# Altium schematic sheet Sheet1.SchDoc
size A3; SheetNumber: 1; SheetTotal: 1
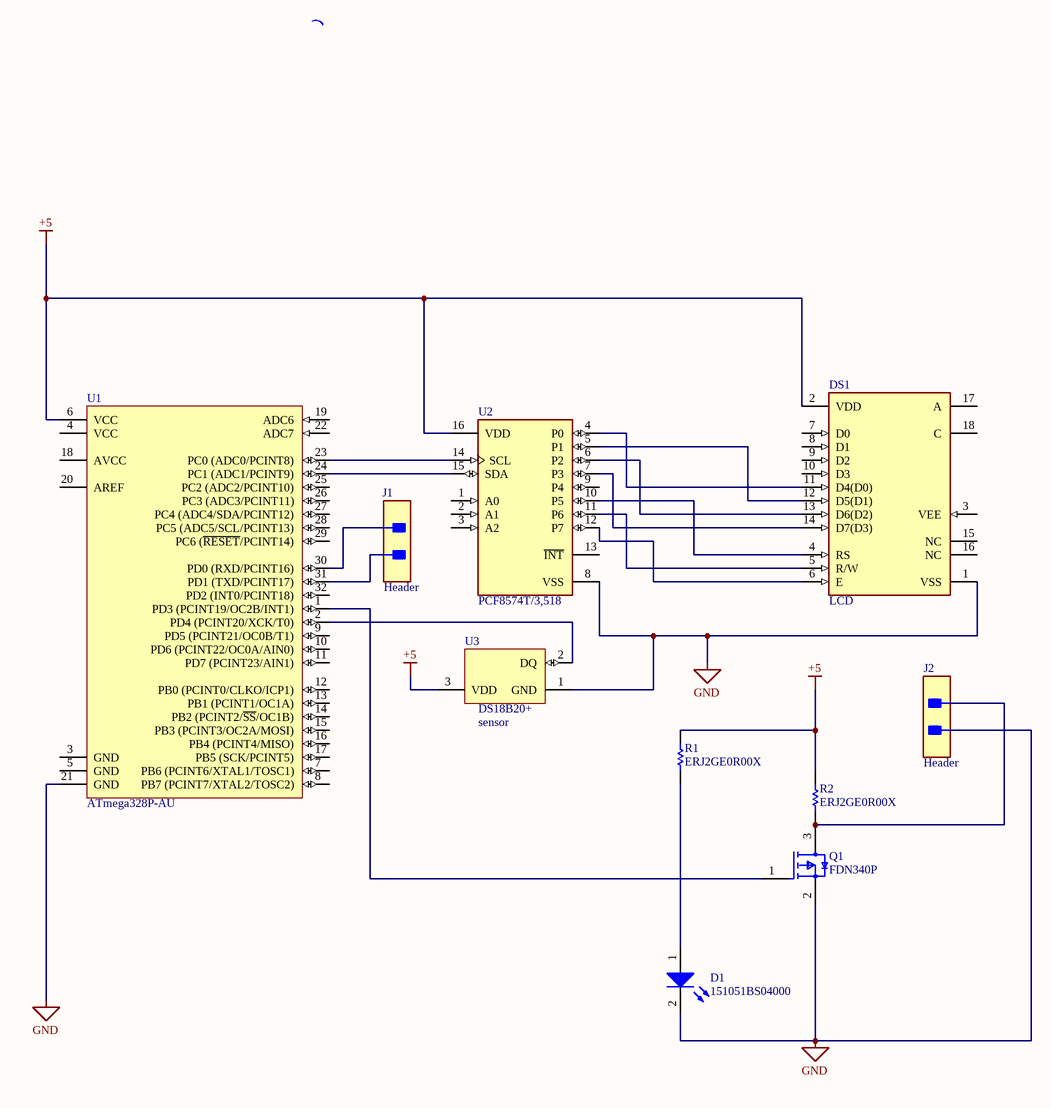
[diagram p0: Sheet1.SchDoc]

## Parts
D1  151051BS04000  [WL-TMRC_D5.9H8.7]
DS1  LCD  [FP-EA_DIP162-DHNLED-MFG]
J1  Header  [FP-SYP-02T-1-MFG]
J2  Header  [FP-SYP-02T-1-MFG]
Q1  FDN340P  [FP-527AG-MFG]
R1  ERJ2GE0R00X  [RESC1005X40X25LL05T05]
R2  ERJ2GE0R00X  [RESC1005X40X25LL05T05]
U1  ATmega328P-AU  [32A_M]
U2  PCF8574T/3,518  [FP-SOT162-1-MFG]
U3  DS18B20+  [Q3+1]

## Nets
+5: DS1.2(VDD) R1.2 R2.2 U1.6(VCC) U2.16(VDD) U3.3(VDD)
GND: D1.2(K) DS1.1(VSS) Q1.2(S) U1.21(GND) U2.8(VSS) U3.1(GND)
NetD1_1: D1.1(A) R1.1
NetDS1_4: DS1.4(RS) U2.10(P5)
NetDS1_5: DS1.5(R/W) U2.11(P6)
NetDS1_6: DS1.6(E) U2.12(P7)
NetDS1_11: DS1.11(D4(D0)) U2.4(P0)
NetDS1_12: DS1.12(D5(D1)) U2.5(P1)
NetDS1_13: DS1.13(D6(D2)) U2.6(P2)
NetDS1_14: DS1.14(D7(D3)) U2.7(P3)
NetQ1_1: Q1.1(G) U1.1(PD3_(PCINT19/OC2B/INT1))
NetQ1_3: Q1.3(D) R2.1
NetU1_2: U1.2(PD4_(PCINT20/XCK/T0)) U3.2(DQ)
NetU1_23: U1.23(PC0_(ADC0/PCINT8)) U2.14(SCL)
NetU1_24: U1.24(PC1_(ADC1/PCINT9)) U2.15(SDA)

Not connected (* = marked no-connect by the designer): DS1 3(VEE) 7(D0) 8(D1) 9(D2) 10(D3) 15(NC) 16(NC) 17(A) 18(C); U1 3(GND) 4(VCC) 5(GND) 7(PB6_(PCINT6/XTAL1/TOSC1)) 8(PB7_(PCINT7/XTAL2/TOSC2)) 9(PD5_(PCINT21/OC0B/T1)) 10(PD6_(PCINT22/OC0A/AIN0)) 11(PD7_(PCINT23/AIN1)) 12(PB0_(PCINT0/CLKO/ICP1)) 13(PB1_(PCINT1/OC1A)) 14(PB2_(PCINT2/~{SS}/OC1B)) 15(PB3_(PCINT3/OC2A/MOSI)) 16(PB4_(PCINT4/MISO)) 17(PB5_(SCK/PCINT5)) 18(AVCC) 19(ADC6) 20(AREF) 22(ADC7) 25(PC2_(ADC2/PCINT10)) 26(PC3_(ADC3/PCINT11)) 27(PC4_(ADC4/SDA/PCINT12)) 28(PC5_(ADC5/SCL/PCINT13)) 29(PC6_(~{RESET}/PCINT14)) 30(PD0_(RXD/PCINT16)) 31(PD1_(TXD/PCINT17)) 32(PD2_(INT0/PCINT18)); U2 1(A0) 2(A1) 3(A2) 9(P4) 13(~{INT})

## Notes on the sheet
- (near U3) sensor

## Library data of the parts
D1 = CMP-1488-00009-2: NexarPartId: 29717812; Test Current: 20mA; Forward Voltage: 3.2V; Wavelength: 470nm; Lens Size: 5mm; Lens Style: Circular, Diffused, Round; Forward Current: 100mA; Peak Wavelength: 465nm; Viewing Angle: 40°; Luminous Intensity: 500mcd; Max Reverse Voltage (DC): 5V; Color: Blue; Case/Package: Radial; Width: 5mm; Mount: Through Hole; Min Operating Temperature: -40°C; Length: 5mm; Height: 8.6mm; Max Operating Temperature: 85°C; Packaging: Bulk; RoHS: Compliant; REACH SVHC: Unknown; Dominant Wavelength: 470nm
DS1 = CMP-140401-000001-1: LCD MOD CHAR 2X16 Y/G BACKLIT; Manufacturer Part Number: EA DIP162-DHNLED; Manufacturer: Display Visions; Number Of Characters: 32; Min Supply Voltage: 2.7V; Max Supply Voltage: 5V; Interface: Parallel; Colour: Yellow/Green; Temperature Range High: +70°C; Device Class L2: Displays; Height: 11mm; Device Class L3: LCD; Display Type: LCD; Package: EA DIP162-DHNLED; Lead Free: Yes; Digikey Description: LCD MOD CHAR 2X16 Y/G BACKLIT; RoHS: TRUE; Device Class L1: Optoelectronics; Automotive: No; ComponentLink2Description: Datasheet; Octopart: https://octopart.com/ea+dip162-dhnled-display+visions-99339882; Temperature Range Low: -20°C; Category: Disp; Temperature: -20°C to +70°C; ComponentLink2URL: https://www.lcd-module.de/fileadmin/eng/pdf/doma/dip162-de.pdf
J1 J2 = CMP-17439-000354-1: CONN PLUG HSNG 2POS 2.5MM RED; Number of Contacts: 2; Gender: Male; Pitch: 0.098inch; Height: 3.2mm; Contact Material: Bronze; Packaging: Bulk; Color: Red; Mount: Free Hanging; Contact Type: Female Socket; Contact Plating: Tin; Number of Rows: 1; Number of Positions: 2; REACH SVHC: No SVHC; Fastening Type: Ramp; Termination: Crimp; Connector Type: Plug; Series: RCY; Housing Material: Nylon; Orientation: Straight
Q1 = CMP-2100-03638-2: MOSFET P-CH 20V 2A SSOT3; Fall Time: 11ns; Rise Time: 9ns; Voltage Rating (DC): -20V; Power Dissipation: 500mW; Nominal Vgs: -800mV; Current Rating: -2A; Gate to Source Voltage (Vgs): 8V; Rds On Max: 70mR; Turn-Off Delay Time: 27ns; Element Configuration: Single; Number of Elements: 1; Input Capacitance: 779pF; Drain to Source Resistance: 60mR; Turn-On Delay Time: 10ns; Package Quantity: 1; Mount: Surface Mount; Case/Package: SOT-23; Min Operating Temperature: -55°C; REACH SVHC: No SVHC; Weight: 0.03g; Packaging: Tape and Reel; Threshold Voltage: -800mV; Max Operating Temperature: 150°C; Dual Supply Voltage: -20V; Termination: SMD/SMT; Drain to Source Voltage (Vdss): 20V; Height: 0.94mm; Length: 2.92mm; Contact Plating: Tin; Width: 3.05mm; Drain to Source Breakdown Voltage: -20V; Max Power Dissipation: 500mW; Continuous Drain Current (ID): 2A; Number of Pins: 3; Lead Free: Lead Free; Radiation Hardening: No; On-State Resistance: 70MR
R1 R2 = CMP-2000-07451-1: Chip Resistor, 0 Ohm, 0.1 W, -55 to 155 degC, 0402 (1005 Metric), RoHS, Tape and Reel; Manufacturer: Panasonic; Voltage Rating (DC): 50V; Temperature Coefficient: 600ppm/��C; Max Power Dissipation: 100mW; Resistance: 0mOhm; Tolerance: 5%; Number of Terminations: 2; Mount: SurfaceMount; Height: 0.35mm; Packaging: TapeandReel; Contact Plating: Tin; Manufacturer URL: http://www.panasonic.com/; Composition: ThickFilm; Max Operating Temperature: 155degC; REACH SVHC: NoSVHC; Case/Package: 0402; Package Reference: 402; Depth: 0.5mm; Package Description: 2-Pin Surface Mount Device, Body 1 x 0.5 mm; Datasheet URL: https://industrial.panasonic.com/cdbs/www-data/pdf/RDA0000/AOA0000C301.pdf; RoHSCompliant: True; Case Code (Imperial): 0402; Military Standard: Not; Min Operating Temperature: -55degC; Power Rating: 100mW; Datasheet Version: 03/2015; Length: 1mm; Case Code (Metric): 1005; Termination: SMD/SMT; Mounting Technology: SurfaceMount; Voltage Rating: 50V; Width: 0.02inch; Package Quantity: 1; Lead Free: LeadFree; Radiation Hardening: No
U1 = CMP-0095-00269-2: 8-bit AVR Microcontroller, 32KB Flash, 1KB EEPROM, 2KB SRAM, 32-pin TQFP, Industrial Grade (-40°C to 85°C); PackageDescription: 32-Lead, 7x7x1.0 mm Body, 0.8mm Lead Pitch, Thin Profile Plastic Quad Flat Package (TQFP); DatasheetVersion: revD, May-2011; RevisionNote: DatasheetVersion & PackageVersion updated. URLs added.; ComponentLink1URL: http://www.atmel.com/; ComponentLink2Description: ATmega48A/48PA/88A/88PA/168A/168PA/328/328P Datasheet; Code_JEDEC: MS-026-ABA; ComponentLink1Description: Manufacturer URL; PackageReference: 32A; ComponentLink3Description: ATmega48A/48PA/88A/88PA/168A/168PA/328/328P Summary; ComponentLink2URL: http://www.atmel.com/dyn/resources/prod_documents/doc8271.pdf; PackageVersion: revC, Oct-2010; ComponentLink3URL: http://www.atmel.com/dyn/resources/prod_documents/8271S.pdf
U2 = CMP-10112-000010-1: IC I/O EXPANDER I2C 8B 16SOIC; Manufacturer: NXP Semiconductors; Frequency: 100kHz; Max Supply Voltage: 6V; Standoff Height: 0.1mm; Nominal Supply Current: 40uA; Max Junction Temp: +125°C; Min Supply Voltage: 2.5V; Number Of I/Os: 8; Manufacturer Part Number: PCF8574T/3,518; Footprint Url: https://www.nxp.com/docs/en/package-information/SOT162-1.pdf; ComponentLink2URL: https://www.nxp.com/docs/en/data-sheet/PCF8574_PCF8574A.pdf; Automotive: No; Digikey Description: IC I/O EXPANDER I2C 8B 16SOIC; Mouser Description: PCF8574 Series 2.5 - 6V Remote 8-bit I/O Expander for I2C-bus - SOIC-16; Ipc Land Pattern Name: SOIC127P1032X265-16; Interface: I2C; Octopart: https://octopart.com/pcf8574t%2F3%2C518-nxp+semiconductors-10470852; Ambient Temperature Range Low: -40°C; Lead Free: Yes; Device Class L2: Interface ICs; Temperature Range High: +85°C; Device Class L1: Integrated Circuits (ICs); Package: SOT162-1; ComponentLink2Description: Datasheet; Device Class L3: I/O Expanders; Temperature: -40°C to +85°C; Ambient Temperature Range High: +85°C; Height: 2.65mm; Category: IC; RoHS: TRUE; Temperature Range Low: -40°C
U3 = CMP-0253-00003-1: Programmable Resolution Digital Thermometer, 1-Wire Interface, ±0.5°C Accuracy, 3-Pin TO92, -55°C to +125°C, Pb-Free; ComponentLink2URL: http://datasheets.maxim-ic.com/en/ds/DS18B20.pdf; PackageReference: Q3+1; ComponentLink1Description: Manufacturer URL; PackageDescription: TO-92 Package, Body Dia. 4.7mm; Leads 0.51 x 0.51 mm (max), Pb-Free; DatasheetVersion: 2007; Code_JEDEC: TO-226-AA; ComponentLink1URL: http://www.maxim-ic.com; PackageVersion: revB, 2009; ComponentLink2Description: Datasheet